# EAGLE schematic guitarduino-schematic (EAGLE 7.2.0)
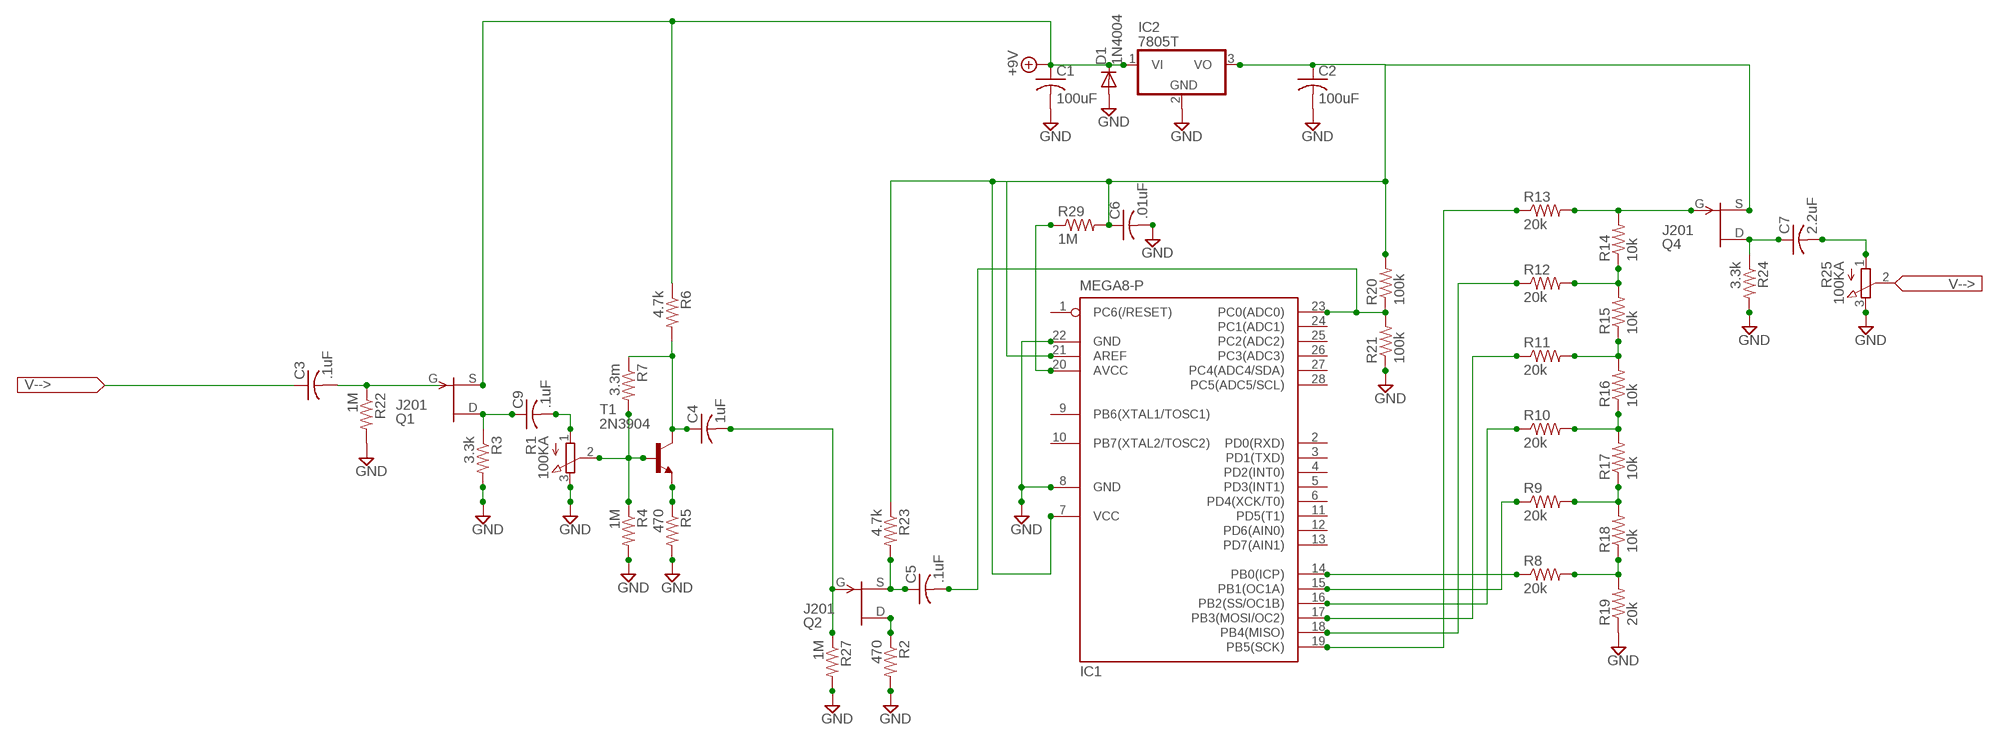
[diagram p0: schematic, sheet 1]

## Parts
C1  100uF  C-US025-025X050  [C025-025X050]
C2  100uF  C-US025-025X050  [C025-025X050]
C3  .1uF  C-US025-025X050  [C025-025X050]
C4  1uF  C-US025-025X050  [C025-025X050]
C5  .1uF  C-US025-025X050  [C025-025X050]
C6  .01uF  C-US025-025X050  [C025-025X050]
C7  2.2uF  C-US025-025X050  [C025-025X050]
C9  .1uF  C-US025-025X050  [C025-025X050]
D1  1N4004  [DO41-10]
IC1  MEGA8-P  [DIL28-3]
IC2  7805T  [TO220H]
Q1  J201  [TO92]
Q2  J201  [TO92]
Q4  J201  [TO92]
R1  100KA  3RP/1610N  [3RP/1610N]
R2  470  R-US_0207/7  [0207/7]
R3  3.3k  R-US_0207/7  [0207/7]
R4  1M  R-US_0207/7  [0207/7]
R5  470  R-US_0207/7  [0207/7]
R6  4.7k  R-US_0207/7  [0207/7]
R7  3.3m  R-US_0207/7  [0207/7]
R8  20k  R-US_0207/7  [0207/7]
R9  20k  R-US_0207/7  [0207/7]
R10  20k  R-US_0207/7  [0207/7]
R11  20k  R-US_0207/7  [0207/7]
R12  20k  R-US_0207/7  [0207/7]
R13  20k  R-US_0207/7  [0207/7]
R14  10k  R-US_0207/7  [0207/7]
R15  10k  R-US_0207/7  [0207/7]
R16  10k  R-US_0207/7  [0207/7]
R17  10k  R-US_0207/7  [0207/7]
R18  10k  R-US_0207/7  [0207/7]
R19  20k  R-US_0207/7  [0207/7]
R20  100k  R-US_0204/7  [0204/7]
R21  100k  R-US_0204/7  [0204/7]
R22  1M  R-US_0207/7  [0207/7]
R23  4.7k  R-US_0207/7  [0207/7]
R24  3.3k  R-US_0207/7  [0207/7]
R25  100KA  3RP/1610N  [3RP/1610N]
R27  1M  R-US_0207/7  [0207/7]
R29  1M  R-US_0207/7  [0207/7]
T1  2N3904  [TO92]

## Nets
+9V: C1.1 D1.C IC2.1(VI) Q1.2(S) R6.1
GND: C1.2 C2.2 C6.2 D1.A IC1.8(GND) IC1.22(GND) IC2.2(GND) R1.3(E) R2.2 R3.2 R4.2 R5.2 R19.1 R21.1 R22.2 R24.2 R25.3(E) R27.2
N$1: C9.1 Q1.3(D) R3.1
N$2: C3.1
N$3: C9.2 R1.1(A)
N$4: R1.2(S) R4.1 R7.2 T1.2(B)
N$5: C4.1 R6.2 R7.1 T1.1(C)
N$6: R5.1 T1.3(E)
N$7: C7.1 Q4.3(D) R24.1
N$8: IC1.14(PB0(ICP)) R8.1
N$9: C3.2 Q1.1(G) R22.1
N$10: IC1.15(PB1(OC1A)) R9.1
N$11: IC1.16(PB2(SS/OC1B)) R10.1
N$12: IC1.17(PB3(MOSI/OC2)) R11.1
N$13: IC1.18(PB4(MISO)) R12.1
N$14: IC1.19(PB5(SCK)) R13.1
N$15: R8.2 R18.1 R19.2
N$16: R9.2 R17.1 R18.2
N$17: R10.2 R16.1 R17.2
N$18: R11.2 R15.1 R16.2
N$19: R12.2 R14.1 R15.2
N$20: Q4.1(G) R13.2 R14.2
N$21: C5.2 IC1.23(PC0(ADC0)) R20.1 R21.2
N$23: C7.2 R25.1(A)
N$30: IC1.20(AVCC) R29.1
N$31: C4.2 Q2.1(G) R27.1
N$32: Q2.3(D) R2.1
N$33: C5.1 Q2.2(S) R23.2
N$35: C2.1 C6.1 IC1.7(VCC) IC1.21(AREF) IC2.3(VO) Q4.2(S) R20.2 R23.1 R29.2
Unconnected: IC1.1(PC6(/RESET)) IC1.2(PD0(RXD)) IC1.3(PD1(TXD)) IC1.4(PD2(INT0)) IC1.5(PD3(INT1)) IC1.6(PD4(XCK/T0)) IC1.9(PB6(XTAL1/TOSC1)) IC1.10(PB7(XTAL2/TOSC2)) IC1.11(PD5(T1)) IC1.12(PD6(AIN0)) IC1.13(PD7(AIN1)) IC1.24(PC1(ADC1)) IC1.25(PC2(ADC2)) IC1.26(PC3(ADC3)) IC1.27(PC4(ADC4/SDA)) IC1.28(PC5(ADC5/SCL)) R25.2(S)

## Library data of the parts
C1-C7 C9 = resistor:C-US: CAPACITOR, American symbol
D1 = diode:1N4004: DIODE general purpose rectifier, 1 A
IC1 = atmel:MEGA8-P: MICROCONTROLLER 8 Kbytes FLASH, 1 kbytes SRAM, 512 bytes EEPROM, USART, 4-channel 10 bit ADC, 2-channel 8 bit ADC Pin compatible with Atmega48, ATMega88, ATMega168 Source: avr.lbr; OC_FARNELL: unknown; OC_NEWARK: unknown
IC2 = linear:78*: Positive VOLTAGE REGULATOR Source: http://cache.national.com/ds/LM/LM78L05.pdf http://www.fairchildsemi.com/ds/LM/LM7805.pdf
Q1 Q2 Q4 = transistor-fet:?20*: TEMIC / Siliconix N-Channel JFET Source: JFET-J201_Siliconix_data.pdf
R1 R25 = pot:3RP/1610N: 16mm Potentiometer one level Source: http://www.alphapotentiometers.net/html/16mm_pot_2.html
R2-R24 R27 R29 = resistor:R-US_: RESISTOR, American symbol
T1 = transistor:2N3904: NPN TRANSISTOR